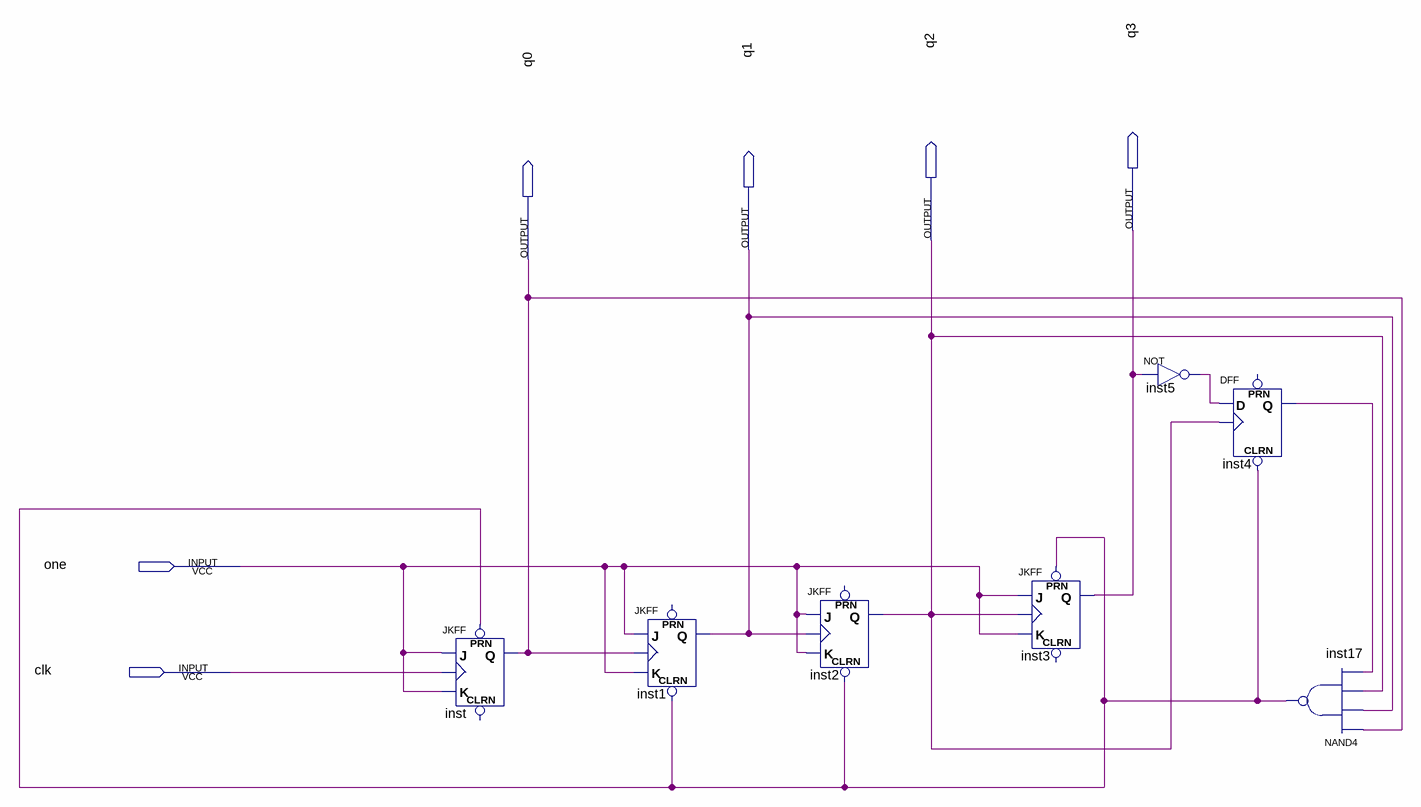
[diagram p0: schematic sheet]
// Quartus schematic contador9_0.bdf as structural Verilog: 7 symbols, 6 pins
module contador9_0 (
  input  one,
  input  clk,
  output q3,
  output q2,
  output q1,
  output q0
);

  wire inst4_q, inst5_out, inst17_out;

  JKFF inst (.PRN(inst17_out), .K(one), .J(one), .CLK(clk), .Q(q0));  // open: CLRN
  JKFF inst1 (.CLRN(inst17_out), .K(one), .J(one), .CLK(q0), .Q(q1));  // open: PRN
  JKFF inst2 (.CLRN(inst17_out), .K(one), .J(one), .CLK(q1), .Q(q2));  // open: PRN
  JKFF inst3 (.PRN(inst17_out), .K(one), .J(one), .CLK(q2), .Q(q3));  // open: CLRN
  not inst5 (inst5_out, q3);
  DFF inst4 (.CLRN(inst17_out), .CLK(q2), .D(inst5_out), .Q(inst4_q));  // open: PRN
  nand inst17 (inst17_out, q0, q1, q2, inst4_q);
endmodule
